# Altium project science_board_proj_rev_2.PrjPcb
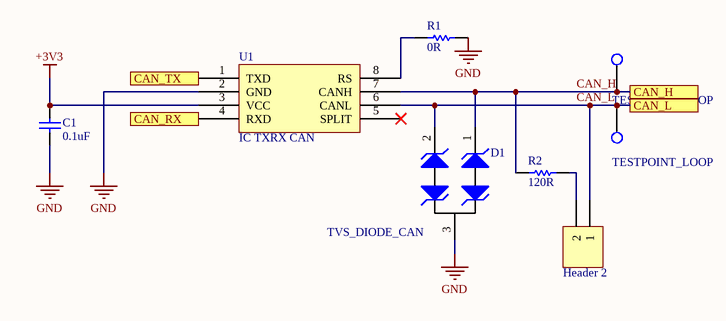
[diagram p0: can.SchDoc]
DrawnBy: Adrianna Ascalon
3 sheets, 41 parts. Net scope: flat (ports and power ports of the same name join across sheets).
Board file: science_board_pcb.PcbDoc
Sheets:
  can.SchDoc
  connectors.SchDoc
  power.SchDoc

## Sheet can.SchDoc: Science Board CAN
size A4

### Parts
1  Header 2  [HDR1X2]
C1  value 0.1uF  [CAPC0603(1608)55_N]  (hidden comment: CAP_0.1uF_16V_0603)
CANH1  TESTPOINT_LOOP  [TESTPOINT_LOOP]
CANL1  TESTPOINT_LOOP  [TESTPOINT_LOOP]
D1  TVS_DIODE_CAN  [TVS_DIODE_CAN]
R1  value 0R  [RESC0603(1608)_N]  (hidden comment: RES_0R_0603)
R2  value 120R  [RESC0603(1608)_N]  (hidden comment: RES_120R_0603)
U1  IC TXRX CAN  [LT-S8_N]

### Ports
CAN_H, CAN_L, CAN_RX, CAN_TX

### Nets
+3V3: C1.2 U1.3(VCC)
GND: C1.1 D1.3 R1.2 U1.2(GND)
CAN_H: CANH1.1(=value) D1.1 R2.1 U1.7(CANH) ; port CAN_H
CAN_L: 1.1 CANL1.1(=value) D1.2 U1.6(CANL) ; port CAN_L
Net1_2: 1.2 R2.2
NetR1_1: R1.1 U1.8(RS)
NetU1_1: U1.1(TXD) ; port CAN_TX
NetU1_4: U1.4(RXD) ; port CAN_RX

Not connected (* = marked no-connect by the designer): U1 5(SPLIT)*

### Library data of the parts
1 = Header 2: Header, 2-Pin; LatestRevisionDate: 17-Jul-2002; LatestRevisionNote: Re-released for DXP Platform.; Publisher: Altium Limited
C1 = CAP_0.1uF_16V_0603: CAP CER 0.1UF 16V X7R 0603; Manufacturer: Yageo; MPN: CC0603KRX7R7BB104; Dimensions: 0.063" L x 0.031" W (1.60mm x 0.80mm); Package: 0603 (1608 Metric); Temperature Coefficient: X7R; Voltage Rating: 16V; Digikey Part Number: 311-1088-1-ND
D1 = TVS_DIODE_CAN: TVS DIODE 24V 41V SOT323-3; Manufacturer: Nexperia USA Inc.; MPN: PESD2CAN,215; Package: SC-70, SOT-323; ComponentLink1Description: Datasheet; ComponentLink1URL: https://assets.nexperia.com/documents/data-sheet/PESD1CAN-U.pdf; Digikey Part Number: 1727-3891-1-ND
R1 = RES_0R_0603: RES SMD 0 OHM JUMPER 1/10W 0603; Manufacturer: Yageo; MPN: RC0603JR-070RL; Package: 0603 (1608 Metric); Dimensions: 0.063" L x 0.031" W (1.60mm x 0.80mm); Digikey Part Number: 311-0.0GRCT-ND
R2 = RES_120R_0603: RES SMD 120 OHM 5% 1/10W 0603; Manufacturer: Yageo; MPN: RC0603JR-07120RL; Package: 0603 (1608 Metric); Dimensions: 0.063" L x 0.031" W (1.60mm x 0.80mm); Tolerance: 5%; Digikey Part Number: 311-120GRCT-ND
U1 = LTC2875: IC TXRX CAN 4MBPS 8SO; Manufacturer: Linear Technologies; MPN: LTC2875IS8#PBF; Package: 8-SOIC (0.154", 3.90mm Width); ComponentLink1Description: Datasheet; ComponentLink1URL: https://www.analog.com/media/en/technical-documentation/data-sheets/2875f.pdf; Digikey Part Number: LTC2875IS8#PBF-ND

## Sheet connectors.SchDoc: Science Board Connectors
size A4; DrawnBy: Adrianna Ascalon
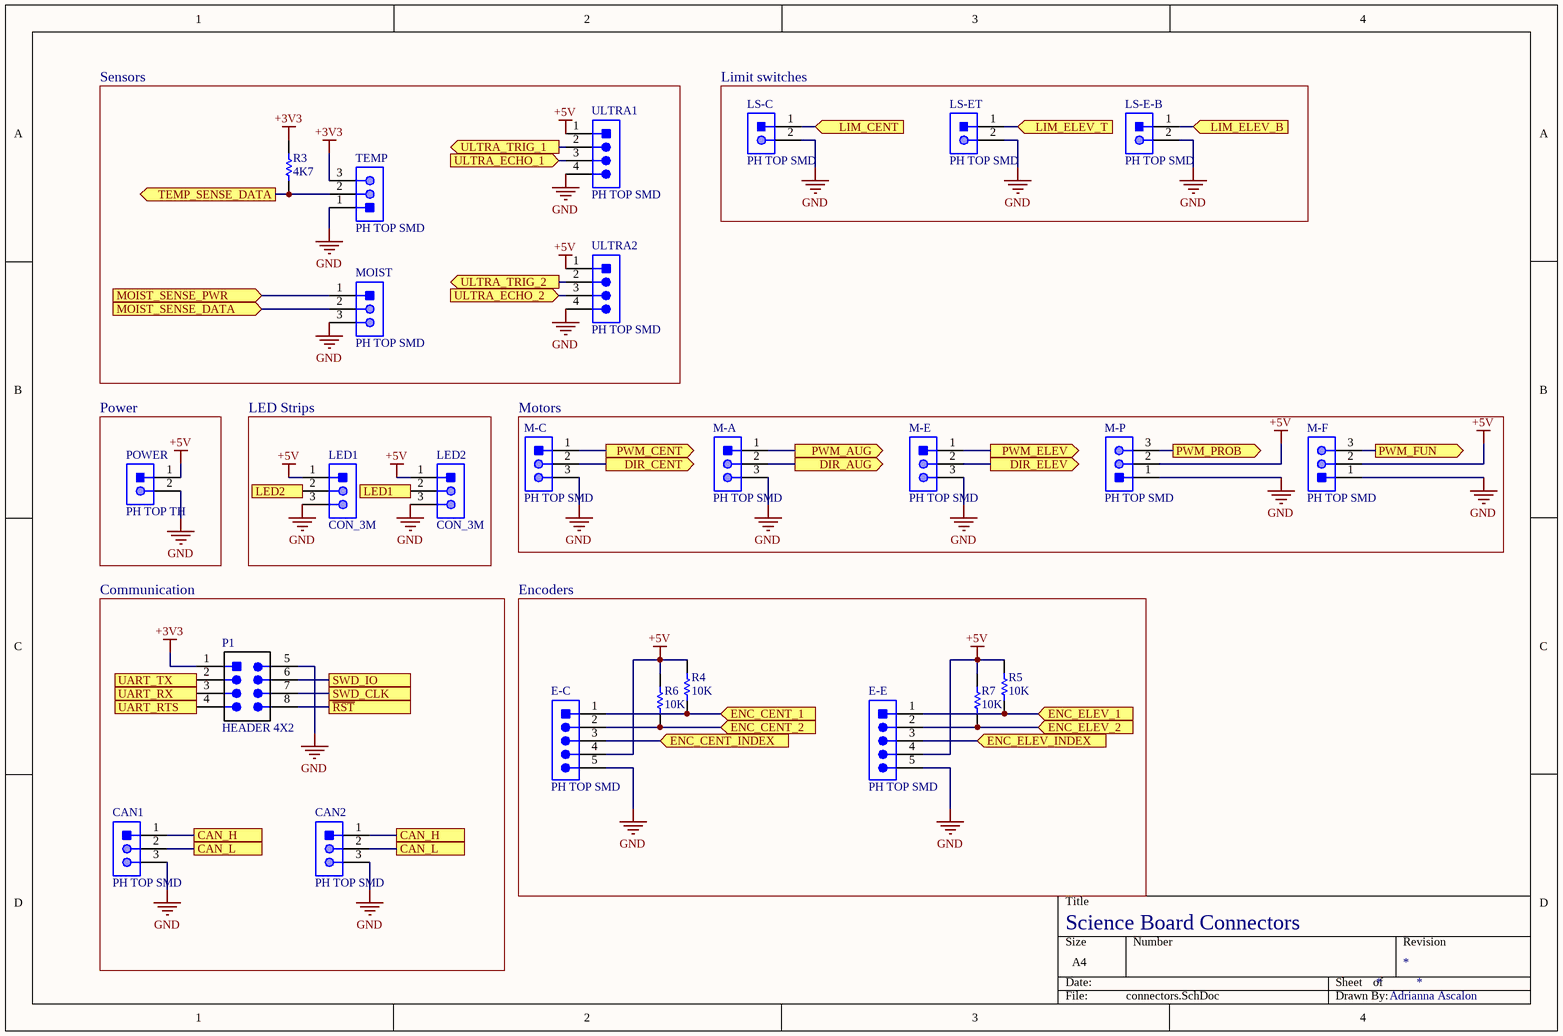
[diagram p1: connectors.SchDoc]

### Parts
CAN1  PH TOP SMD  [JST-B3B-SM4-TB]
CAN2  PH TOP SMD  [JST-B3B-SM4-TB]
E-C  PH TOP SMD  [JST-B5B-SM4-TB]
E-E  PH TOP SMD  [JST-B5B-SM4-TB]
LED1  CON_3M  [JST-B3B-SM4-TB]
LED2  CON_3M  [JST-B3B-SM4-TB]
LS-C  PH TOP SMD  [JST-B2B-SM4-TB]
LS-E-B  PH TOP SMD  [JST-B2B-SM4-TB]
LS-ET  PH TOP SMD  [JST-B2B-SM4-TB]
M-A  PH TOP SMD  [JST-B3B-SM4-TB]
M-C  PH TOP SMD  [JST-B3B-SM4-TB]
M-E  PH TOP SMD  [JST-B3B-SM4-TB]
M-F  PH TOP SMD  [JST-B3B-SM4-TB]
M-P  PH TOP SMD  [JST-B3B-SM4-TB]
MOIST  PH TOP SMD  [JST-B3B-SM4-TB]
P1  HEADER 4X2  [HEADER_2X4]
POWER  PH TOP TH  [JST-B2B-PHSK]
R3  value 4K7  [RESC0603(1608)_N]  (hidden comment: RES_4K7_0603)
R4  value 10K  [RESC0603(1608)_N]  (hidden comment: RES_10K_0603)
R5  value 10K  [RESC0603(1608)_N]  (hidden comment: RES_10K_0603)
R6  value 10K  [RESC0603(1608)_N]  (hidden comment: RES_10K_0603)
R7  value 10K  [RESC0603(1608)_N]  (hidden comment: RES_10K_0603)
TEMP  PH TOP SMD  [JST-B3B-SM4-TB]
ULTRA1  PH TOP SMD  [JST-B4B-SM4-TB]
ULTRA2  PH TOP SMD  [JST-B4B-SM4-TB]

### Blocks framed on the sheet
Sensors: MOIST R3 TEMP ULTRA1 ULTRA2
Limit switches: LS-C LS-E-B LS-ET
Power: POWER
LED Strips: LED1 LED2
Motors: M-A M-C M-E M-F M-P
Communication: CAN1 CAN2 P1
Encoders: E-C E-E R4-R7

### Ports
CAN_H, CAN_L, DIR_AUG (out), DIR_CENT (out), DIR_ELEV (out), ENC_CENT_1 (in), ENC_CENT_2 (in), ENC_CENT_INDEX (in), ENC_ELEV_1 (in), ENC_ELEV_2 (in), ENC_ELEV_INDEX (in), LED1, LED2, LIM_CENT (in), LIM_ELEV_B (in), LIM_ELEV_T (in), MOIST_SENSE_DATA (in), MOIST_SENSE_PWR (in), PWM_AUG (out), PWM_CENT (out), PWM_ELEV (out), PWM_FUN (out), PWM_PROB (out), SWD_CLK, SWD_IO, TEMP_SENSE_DATA (out), UART_RTS, UART_RX (in), UART_TX (out), ULTRA_ECHO_1 (in), ULTRA_ECHO_2 (in), ULTRA_TRIG_1 (out), ULTRA_TRIG_2 (out), ~{RST}

### Nets
+3V3: P1.1(VCC) R3.2 TEMP.3
+5V: E-C.4 E-E.4 LED1.1 LED2.1 M-F.2 M-P.2 POWER.1 R4.2 R5.2 R6.2 R7.2 ULTRA1.1 ULTRA2.1
GND: CAN1.3 CAN2.3 E-C.5 E-E.5 LED1.3 LED2.3 LS-C.2 LS-E-B.2 LS-ET.2 M-A.3 M-C.3 M-E.3 M-F.1 M-P.1 MOIST.3 P1.5(GND) POWER.2 TEMP.1 ULTRA1.4 ULTRA2.4
CAN_H: CAN1.1 CAN2.1 ; port CAN_H
CAN_L: CAN1.2 CAN2.2 ; port CAN_L
NetE-C_1: E-C.1 R4.1 ; port ENC_CENT_1
NetE-C_2: E-C.2 R6.1 ; port ENC_CENT_2
NetE-C_3: E-C.3 ; port ENC_CENT_INDEX
NetE-E_1: E-E.1 R5.1 ; port ENC_ELEV_1
NetE-E_2: E-E.2 R7.1 ; port ENC_ELEV_2
NetE-E_3: E-E.3 ; port ENC_ELEV_INDEX
NetLED1_2: LED1.2 ; port LED2
NetLED2_2: LED2.2 ; port LED1
NetLS-C_1: LS-C.1 ; port LIM_CENT
NetLS-E-B_1: LS-E-B.1 ; port LIM_ELEV_B
NetLS-ET_1: LS-ET.1 ; port LIM_ELEV_T
NetM-A_1: M-A.1 ; port PWM_AUG
NetM-A_2: M-A.2 ; port DIR_AUG
NetM-C_1: M-C.1 ; port PWM_CENT
NetM-C_2: M-C.2 ; port DIR_CENT
NetM-E_1: M-E.1 ; port PWM_ELEV
NetM-E_2: M-E.2 ; port DIR_ELEV
NetM-F_3: M-F.3 ; port PWM_FUN
NetM-P_3: M-P.3 ; port PWM_PROB
NetMOIST_1: MOIST.1 ; port MOIST_SENSE_PWR
NetMOIST_2: MOIST.2 ; port MOIST_SENSE_DATA
NetP1_2: P1.2 ; port UART_TX
NetP1_3: P1.3 ; port UART_RX
NetP1_4: P1.4 ; port UART_RTS
NetP1_6: P1.6 ; port SWD_IO
NetP1_7: P1.7 ; port SWD_CLK
NetP1_8: P1.8 ; port ~{RST}
NetR3_1: R3.1 TEMP.2 ; port TEMP_SENSE_DATA
NetULTRA1_2: ULTRA1.2 ; port ULTRA_TRIG_1
NetULTRA1_3: ULTRA1.3 ; port ULTRA_ECHO_1
NetULTRA2_2: ULTRA2.2 ; port ULTRA_TRIG_2
NetULTRA2_3: ULTRA2.3 ; port ULTRA_ECHO_2

### Library data of the parts
CAN1 CAN2 M-A M-C M-E M-F M-P MOIST TEMP = CON_3M_PH_TOP_SMT: CONN HEADER PH TOP 3POS 2MM SMD; Manufacturer: JST; Part Number: B3B-PH-SM4-TB; ComponentLink1Description: Datasheet; ComponentLink1URL: http://www.jst-mfg.com/product/pdf/eng/ePH.pdf
E-C E-E = CON_5M_PH_TOP_SMT: CONN HEADER PH TOP 5POS 2MM SMD; Manufacturer: JST; Part Number: B5B-PH-SM4-TB; ComponentLink1Description: Datasheet; ComponentLink1URL: http://www.jst-mfg.com/product/pdf/eng/ePH.pdf
LS-C LS-E-B LS-ET = CON_2M_PH_TOP_SMT: CONN HEADER PH TOP 2POS 2MM SMD; Manufacturer: JST; Part Number: B2B-PH-SM4-TB; ComponentLink1Description: Datasheet; ComponentLink1URL: http://www.jst-mfg.com/product/pdf/eng/ePH.pdf
P1 = HEADER 4X2: Header, 4-Pin Dual row; MPN: GRPB042VWVN-RC; Manufacturer: Sullins Connector Solutions; Digikey Part Number: S9015E-04-ND
POWER = CON_2M_PH_TOP_TH: CONN HEADER PH TOP 2POS 2MM; Manufacturer: JST; Part Number: B2B-PH-K-S; ComponentLink1Description: Datasheet; ComponentLink1URL: http://www.jst-mfg.com/product/pdf/eng/ePH.pdf
R3 = RES_4K7_0603: RES SMD 4.7K OHM 5% 1/10W 0603; Manufacturer: Yageo; MPN: RC0603JR-074K7L; Package: 0603 (1608 Metric); Dimensions: 0.063" L x 0.031" W (1.60mm x 0.80mm); Tolerance: 5%; Digikey Part Number: 311-4.7KGRCT-ND
R4-R7 = RES_10K_0603: RES SMD 10K OHM 5% 1/10W 0603; Manufacturer: Yageo; MPN: RC0603JR-0710KL; Package: 0603 (1608 Metric); Dimensions: 0.063" L x 0.031" W (1.60mm x 0.80mm); Tolerance: 5%; Digikey Part Number: 311-10KGRCT-ND
ULTRA1 ULTRA2 = CON_4M_PH_TOP_SMT: CONN HEADER PH TOP 4POS 2MM SMD; Manufacturer: JST; Part Number: B4B-PH-SM4-TB; ComponentLink1Description: Datasheet; ComponentLink1URL: http://www.jst-mfg.com/product/pdf/eng/ePH.pdf

## Sheet power.SchDoc: Power
size A4; DrawnBy: Adrianna Ascalon
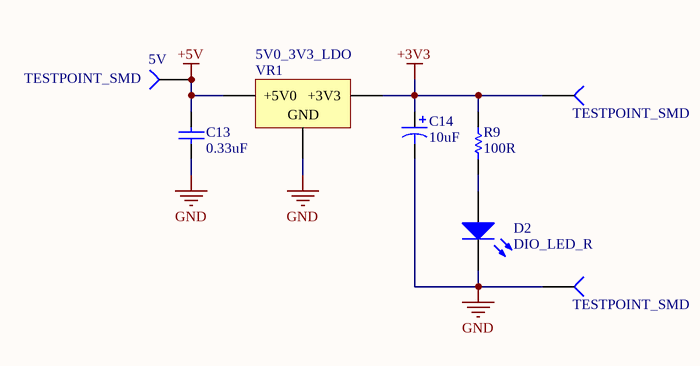
[diagram p2: power.SchDoc]

### Parts
3V3  TESTPOINT_SMD  [TESTPOINT]
5V  TESTPOINT_SMD  [TESTPOINT]
C13  value 0.33uF  [CAPC0603(1608)55_N]  (hidden comment: CAP_0.33uF_16V_0603)
C14  value 10uF  [AVX-CAPC3528_V]  (hidden comment: CAP_10uF_1411_POL)
D2  DIO_LED_R  [LED_0805_LINE]
GND  TESTPOINT_SMD  [TESTPOINT]
R9  value 100R  [RESC0603(1608)_N]  (hidden comment: RES_100R_0603)
VR1  5V0_3V3_LDO  [VOLTAGE_REGULATOR]

### Nets
+3V3: 3V3.1(=value) C14.1 R9.2 VR1.2(+3V3)
+5V: 5V.1(=value) C13.2 VR1.3(+5V0)
GND: C13.1 C14.2 D2.2(K) GND.1(=value) VR1.1(GND)
NetD2_1: D2.1(A) R9.1

### Library data of the parts
C13 = CAP_0.33uF_16V_0603: CAP CER 0.33UF 16V X7R 0603; Manufacturer: Murata Electronics North America; MPN: GCM188R71C334KA37D; Dimensions: 0.063" L x 0.031" W (1.60mm x 0.80mm); Package: 0603 (1608 Metric); Temperature Coefficient: X7R; Voltage Rating: 16V; Digikey Part Number: 490-6050-1-ND
C14 = CAP_10uF_1411_POL: CAP TANT 10UF 20% 10V 1411; MPN: F971A106MBAHT3; Manufacturer: AVX Corporation; Dimensions: 0.063" L x 0.031" W (1.60mm x 0.80mm); Package: 1411 (3528 Metric); Voltage Rating: 10V; Digikey Part Number: 478-12047-1-ND
D2 = DIO_LED_R: LED RED DIFFUSED 0805 SMD; Manufacturer: OSRAM; MPN: LS R976-NR-1; Forward Voltage Drop: 2V; Package: 0805 (2012 Metric); Digikey Part Number: 475-1278-1-ND
R9 = RES_100R_0603: RES SMD 100 OHM 1% 1/10W 0603; Manufacturer: Yageo; MPN: RC0603FR-07100RL; Package: 0603 (1608 Metric); Dimensions: 0.063" L x 0.031" W (1.60mm x 0.80mm); Tolerance: 1%; Digikey Part Number: 311-100HRCT-ND
VR1 = 5V0_3V3_LDO: IC REG LINEAR 3.3V 1A DPAK; Manufacturer: ON Semiconductor; MPN: NCP1117DT33T5G; Current Output: 1A; Digikey Part Number: NCP1117DT33T5GOSCT-ND
3V3 5V GND = TESTPOINT_SMD: Part Number (MPN): *

## Nets that join several sheets
+3V3: can (C1.2 U1.3), connectors (P1.1 R3.2 TEMP.3), power (3V3.1 C14.1 R9.2 VR1.2)
+5V: connectors (13 pins), power (5V.1 C13.2 VR1.3)
GND: can (C1.1 D1.3 R1.2 U1.2), connectors (20 pins), power (5 pins)
CAN_H: can (CANH1.1 D1.1 R2.1 U1.7), connectors (CAN1.1 CAN2.1)
CAN_L: can (1.1 CANL1.1 D1.2 U1.6), connectors (CAN1.2 CAN2.2)